# Altium project pcb.PrjPcb
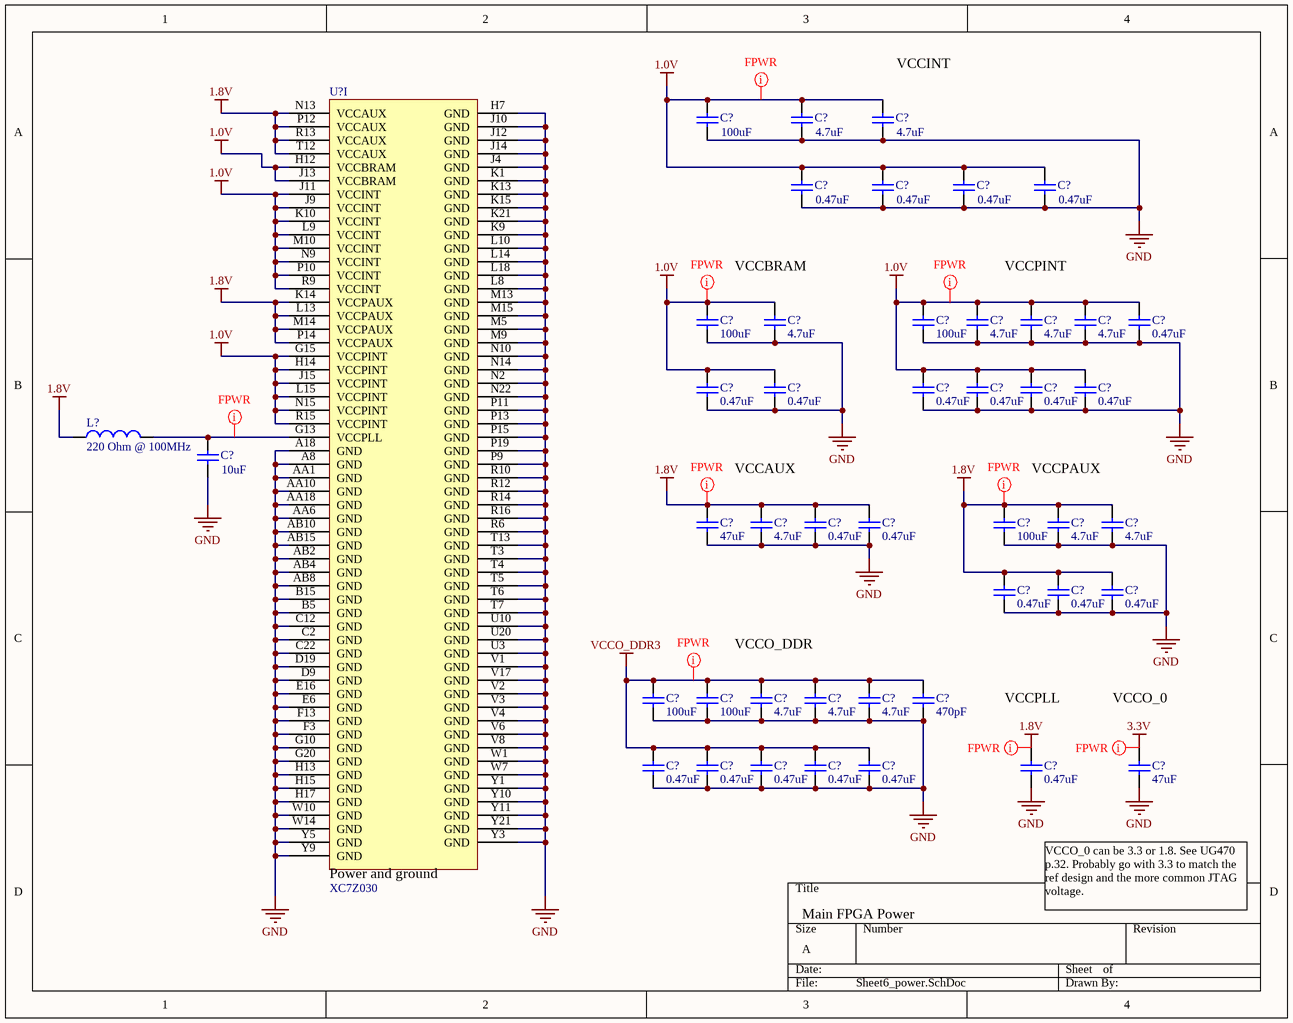
[diagram p0: Sheet6_power.SchDoc]
6 sheets, 46 parts. Net scope: global (net labels, ports and power ports of the same name join across sheets).
Board file: savr.PcbDoc
Sheets:
  Sheet1_gpio.SchDoc
  Sheet2_ethernet.SchDoc
  Sheet3_ddr.SchDoc
  Sheet4_gtp.SchDoc
  Sheet5_config.SchDoc
  Sheet6_power.SchDoc

## Sheet Sheet1_gpio.SchDoc
size A

## Sheet Sheet2_ethernet.SchDoc
size A

## Sheet Sheet3_ddr.SchDoc
size A

## Sheet Sheet4_gtp.SchDoc
size A

## Sheet Sheet5_config.SchDoc
size A

## Sheet Sheet6_power.SchDoc
size A

### Parts
(Parts that share a designator on the sheet are numbered #1, #2 ... from top to bottom, then left to right.)
C?#1  value 100uF  [1608[0603]]  (hidden comment: Cap Semi)
C?#2  value 4.7uF  [1608[0603]]  (hidden comment: Cap Semi)
C?#3  value 4.7uF  [1608[0603]]  (hidden comment: Cap Semi)
C?#4  value 0.47uF  [1608[0603]]  (hidden comment: Cap Semi)
C?#5  value 0.47uF  [1608[0603]]  (hidden comment: Cap Semi)
C?#6  value 0.47uF  [1608[0603]]  (hidden comment: Cap Semi)
C?#7  value 0.47uF  [1608[0603]]  (hidden comment: Cap Semi)
C?#8  value 100uF  [1608[0603]]  (hidden comment: Cap Semi)
C?#9  value 4.7uF  [1608[0603]]  (hidden comment: Cap Semi)
C?#10  value 100uF  [1608[0603]]  (hidden comment: Cap Semi)
C?#11  value 4.7uF  [1608[0603]]  (hidden comment: Cap Semi)
C?#12  value 4.7uF  [1608[0603]]  (hidden comment: Cap Semi)
C?#13  value 4.7uF  [1608[0603]]  (hidden comment: Cap Semi)
C?#14  value 0.47uF  [1608[0603]]  (hidden comment: Cap Semi)
C?#15  value 0.47uF  [1608[0603]]  (hidden comment: Cap Semi)
C?#16  value 0.47uF  [1608[0603]]  (hidden comment: Cap Semi)
C?#17  value 0.47uF  [1608[0603]]  (hidden comment: Cap Semi)
C?#18  value 0.47uF  [1608[0603]]  (hidden comment: Cap Semi)
C?#19  value 0.47uF  [1608[0603]]  (hidden comment: Cap Semi)
C?#20  value 0.47uF  [1608[0603]]  (hidden comment: Cap Semi)
C?#21  value 10uF  [1608[0603]]  (hidden comment: Cap Semi)
C?#22  value 47uF  [1608[0603]]  (hidden comment: Cap Semi)
C?#23  value 4.7uF  [1608[0603]]  (hidden comment: Cap Semi)
C?#24  value 0.47uF  [1608[0603]]  (hidden comment: Cap Semi)
C?#25  value 0.47uF  [1608[0603]]  (hidden comment: Cap Semi)
C?#26  value 100uF  [1608[0603]]  (hidden comment: Cap Semi)
C?#27  value 4.7uF  [1608[0603]]  (hidden comment: Cap Semi)
C?#28  value 4.7uF  [1608[0603]]  (hidden comment: Cap Semi)
C?#29  value 0.47uF  [1608[0603]]  (hidden comment: Cap Semi)
C?#30  value 0.47uF  [1608[0603]]  (hidden comment: Cap Semi)
C?#31  value 0.47uF  [1608[0603]]  (hidden comment: Cap Semi)
C?#32  value 100uF  [1608[0603]]  (hidden comment: Cap Semi)
C?#33  value 100uF  [1608[0603]]  (hidden comment: Cap Semi)
C?#34  value 4.7uF  [1608[0603]]  (hidden comment: Cap Semi)
C?#35  value 4.7uF  [1608[0603]]  (hidden comment: Cap Semi)
C?#36  value 4.7uF  [1608[0603]]  (hidden comment: Cap Semi)
C?#37  value 470pF  [1608[0603]]  (hidden comment: Cap Semi)
C?#38  value 0.47uF  [1608[0603]]  (hidden comment: Cap Semi)
C?#39  value 0.47uF  [1608[0603]]  (hidden comment: Cap Semi)
C?#40  value 0.47uF  [1608[0603]]  (hidden comment: Cap Semi)
C?#41  value 0.47uF  [1608[0603]]  (hidden comment: Cap Semi)
C?#42  value 0.47uF  [1608[0603]]  (hidden comment: Cap Semi)
C?#43  value 0.47uF  [1608[0603]]  (hidden comment: Cap Semi)
C?#44  value 47uF  [1608[0603]]  (hidden comment: Cap Semi)
L?  220 Ohm @ 100MHz  [0603]
U?  XC7Z030  (part I of 9)

### Nets
1.0V: C?#1.2 C?#2.2 C?#3.2 C?#4.2 C?#5.2 C?#6.2 C?#7.2 C?#8.2 C?#9.2 C?#10.2 C?#11.2 C?#12.2 C?#13.2 C?#14.2 C?#15.2 C?#16.2 C?#17.2 C?#18.2 C?#19.2 C?#20.2 U?.G15(VCCPINT) U?.H12(VCCBRAM) U?.H14(VCCPINT) U?.J9(VCCINT) U?.J11(VCCINT) U?.J13(VCCBRAM) U?.J15(VCCPINT) U?.K10(VCCINT) U?.L9(VCCINT) U?.L15(VCCPINT) U?.M10(VCCINT) U?.N9(VCCINT) U?.N15(VCCPINT) U?.P10(VCCINT) U?.R9(VCCINT) U?.R15(VCCPINT)
1.8V: C?#22.2 C?#23.2 C?#24.2 C?#25.2 C?#26.2 C?#27.2 C?#28.2 C?#29.2 C?#30.2 C?#31.2 C?#43.2 L?.1 U?.K14(VCCPAUX) U?.L13(VCCPAUX) U?.M14(VCCPAUX) U?.N13(VCCAUX) U?.P12(VCCAUX) U?.P14(VCCPAUX) U?.R13(VCCAUX) U?.T12(VCCAUX)
3.3V: C?#44.2
GND: C?#1.1 C?#2.1 C?#3.1 C?#4.1 C?#5.1 C?#6.1 C?#7.1 C?#8.1 C?#9.1 C?#10.1 C?#11.1 C?#12.1 C?#13.1 C?#14.1 C?#15.1 C?#16.1 C?#17.1 C?#18.1 C?#19.1 C?#20.1 C?#21.1 C?#22.1 C?#23.1 C?#24.1 C?#25.1 C?#26.1 C?#27.1 C?#28.1 C?#29.1 C?#30.1 C?#31.1 C?#32.1 C?#33.1 C?#34.1 C?#35.1 C?#36.1 C?#37.1 C?#38.1 C?#39.1 C?#40.1 C?#41.1 C?#42.1 C?#43.1 C?#44.1 U?.A8(GND) U?.A18(GND) U?.AA1(GND) U?.AA6(GND) U?.AA10(GND) U?.AA18(GND) U?.AB2(GND) U?.AB4(GND) U?.AB8(GND) U?.AB10(GND) U?.AB15(GND) U?.B5(GND) U?.B15(GND) U?.C2(GND) U?.C12(GND) U?.C22(GND) U?.D9(GND) U?.D19(GND) U?.E6(GND) U?.E16(GND) U?.F3(GND) U?.F13(GND) U?.G10(GND) U?.G20(GND) U?.H7(GND) U?.H13(GND) U?.H15(GND) U?.H17(GND) U?.J4(GND) U?.J10(GND) U?.J12(GND) U?.J14(GND) U?.K1(GND) U?.K9(GND) U?.K13(GND) U?.K15(GND) U?.K21(GND) U?.L8(GND) U?.L10(GND) U?.L14(GND) U?.L18(GND) U?.M5(GND) U?.M9(GND) U?.M13(GND) U?.M15(GND) U?.N2(GND) U?.N10(GND) U?.N14(GND) U?.N22(GND) U?.P9(GND) U?.P11(GND) U?.P13(GND) U?.P15(GND) U?.P19(GND) U?.R6(GND) U?.R10(GND) U?.R12(GND) U?.R14(GND) U?.R16(GND) U?.T3(GND) U?.T4(GND) U?.T5(GND) U?.T6(GND) U?.T7(GND) U?.T13(GND) U?.U3(GND) U?.U10(GND) U?.U20(GND) U?.V1(GND) U?.V2(GND) U?.V3(GND) U?.V4(GND) U?.V6(GND) U?.V8(GND) U?.V17(GND) U?.W1(GND) U?.W7(GND) U?.W10(GND) U?.W14(GND) U?.Y1(GND) U?.Y3(GND) U?.Y5(GND) U?.Y9(GND) U?.Y10(GND) U?.Y11(GND) U?.Y21(GND)
VCCO_DDR3: C?#32.2 C?#33.2 C?#34.2 C?#35.2 C?#36.2 C?#37.2 C?#38.2 C?#39.2 C?#40.2 C?#41.2 C?#42.2
NetC?#21_2: C?#21.2 L?.2 U?.G13(VCCPLL)

### Layout directives
net class FPWR: 1.0V, 1.8V, 3.3V, NetC?#21_2, VCCO_DDR3

### Notes on the sheet
- (near C?#3) VCCINT
- (near C?#9) VCCBRAM
- (near C?#12) VCCPINT
- (near C?#23) VCCAUX
- (near C?#27) VCCPAUX
- (near C?#34) VCCO_DDR
- VCCPLL
- VCCO_0
- VCCO_0 can be 3.3 or 1.8. See UG470 p.32. Probably go with 3.3 to match the ref design and the more common JTAG voltage.
- Main FPGA Power
- (in symbol Zynq030_SBG485, part I) Power and ground

### Library data of the parts
C?#1-C?#44 = Cap Semi: Capacitor (Semiconductor SIM Model); Published: 8-Jun-2000; LatestRevisionDate: 29-May-2009; LatestRevisionNote: IPC-7351 Footprint Added.; PackageReference: C1206; Publisher: Altium Limited; PackageDescription: Chip Capacitor
L? = Inductor: Code_IEC: 1005; Published: 8-Jun-2000; LatestRevisionDate: 29-May-2009; LatestRevisionNote: IPC-7351 Footprint Added.; PackageReference: 0402-A; Publisher: Altium Limited; PackageDescription: Chip Inductor; Code_JEITA: 0402
U? = Zynq030_SBG485: Xilinx Zynq 7Z030 in SBG485 package; Digikey: 122-2190-ND